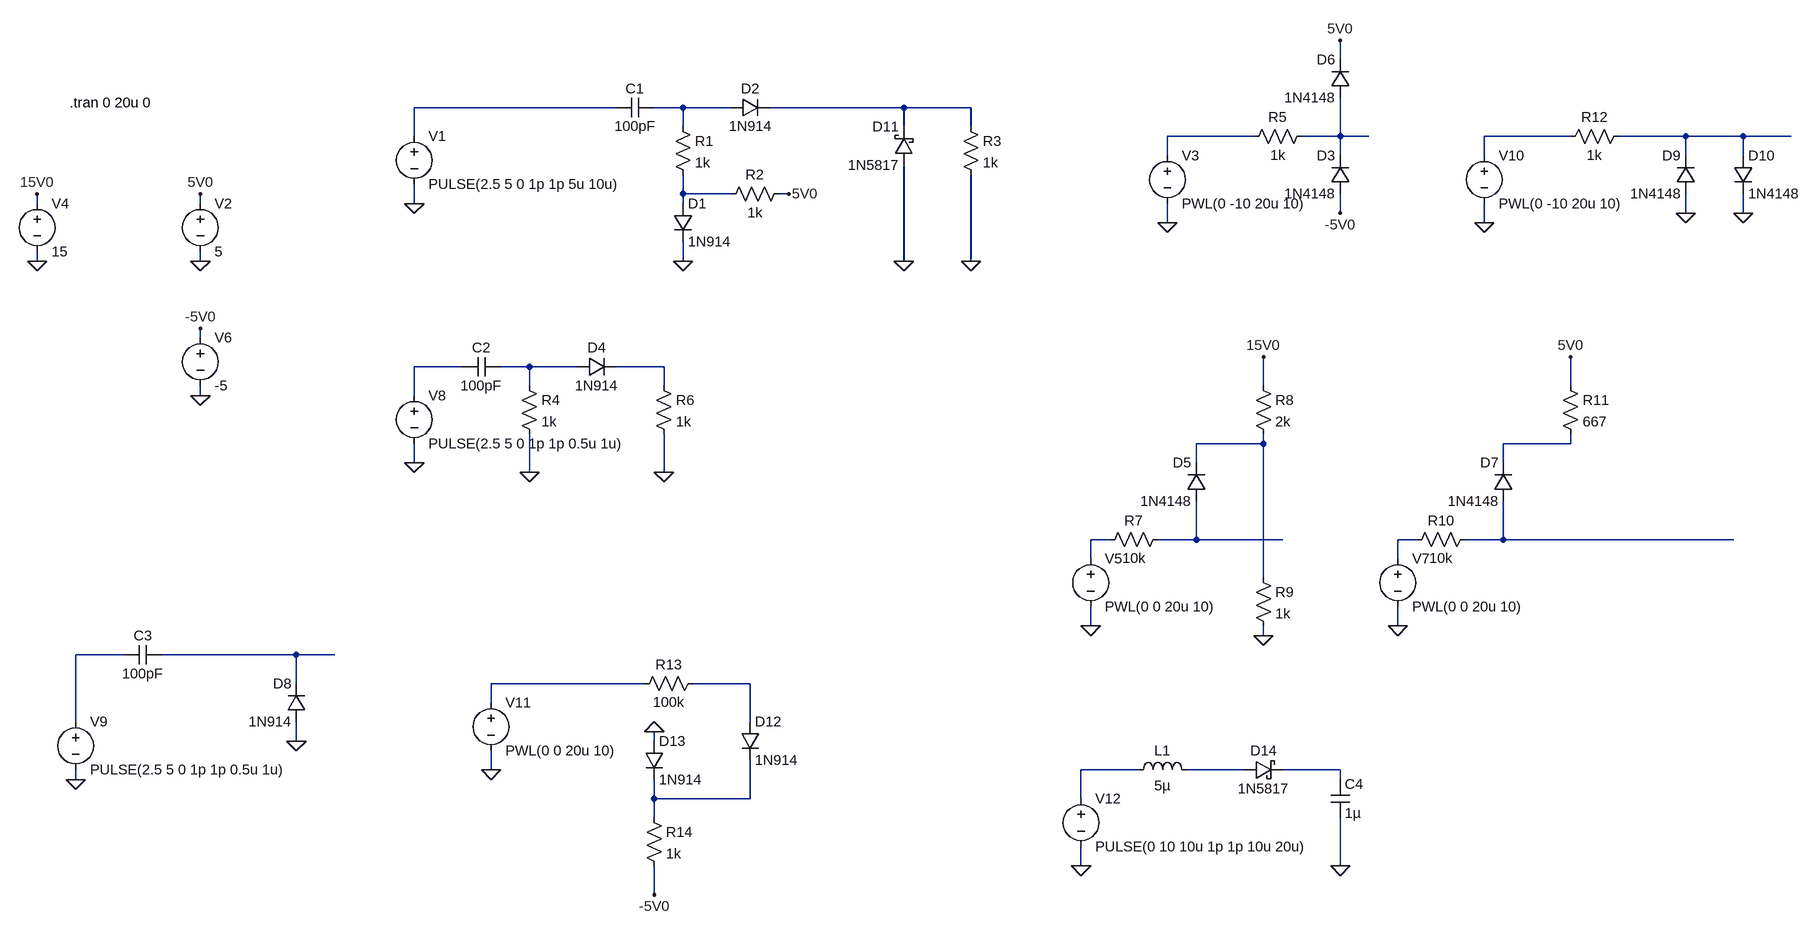
[diagram p0: schematic chapter 1.asc]
chapter 1.asc, the LTspice schematic file:
Version 4
SHEET 1 2712 1636
WIRE 1936 144 1936 112
WIRE 560 224 224 224
WIRE 672 224 624 224
WIRE 752 224 672 224
WIRE 1040 224 816 224
WIRE 1152 224 1040 224
WIRE 672 256 672 224
WIRE 1040 256 1040 224
WIRE 1152 256 1152 224
WIRE 224 272 224 224
WIRE 1792 272 1648 272
WIRE 1936 272 1936 208
WIRE 1936 272 1872 272
WIRE 1984 272 1936 272
WIRE 2320 272 2176 272
WIRE 2512 272 2400 272
WIRE 2608 272 2512 272
WIRE 2688 272 2608 272
WIRE 1648 304 1648 272
WIRE 1936 304 1936 272
WIRE 2176 304 2176 272
WIRE 2512 304 2512 272
WIRE 2608 304 2608 272
WIRE 672 368 672 336
WIRE 752 368 672 368
WIRE 848 368 832 368
WIRE -608 384 -608 368
WIRE -336 384 -336 368
WIRE 224 384 224 352
WIRE 672 384 672 368
WIRE 1936 400 1936 368
WIRE 2512 400 2512 368
WIRE 2608 400 2608 368
WIRE 1648 416 1648 384
WIRE 2176 416 2176 384
WIRE -608 480 -608 464
WIRE -336 480 -336 464
WIRE 672 480 672 448
WIRE 1040 480 1040 320
WIRE 1152 480 1152 336
WIRE -336 608 -336 592
WIRE 304 656 224 656
WIRE 416 656 368 656
WIRE 496 656 416 656
WIRE 640 656 560 656
WIRE 416 688 416 656
WIRE 640 688 640 656
WIRE 1808 688 1808 640
WIRE 2320 688 2320 640
WIRE -336 704 -336 688
WIRE 224 704 224 656
WIRE 1808 784 1808 768
WIRE 1808 784 1696 784
WIRE 2320 784 2320 768
WIRE 2320 784 2208 784
WIRE 224 816 224 784
WIRE 1696 816 1696 784
WIRE 2208 816 2208 784
WIRE 416 832 416 768
WIRE 640 832 640 768
WIRE 1552 944 1520 944
WIRE 1696 944 1696 880
WIRE 1696 944 1632 944
WIRE 1840 944 1696 944
WIRE 2064 944 2032 944
WIRE 2208 944 2208 880
WIRE 2208 944 2144 944
WIRE 2592 944 2208 944
WIRE 1520 976 1520 944
WIRE 2032 976 2032 944
WIRE 1808 1008 1808 784
WIRE 1520 1088 1520 1056
WIRE 2032 1088 2032 1056
WIRE 1808 1104 1808 1088
WIRE -464 1136 -544 1136
WIRE -176 1136 -400 1136
WIRE -112 1136 -176 1136
WIRE -176 1184 -176 1136
WIRE 608 1184 352 1184
WIRE 784 1184 688 1184
WIRE 352 1216 352 1184
WIRE -544 1248 -544 1136
WIRE 784 1248 784 1184
WIRE -176 1280 -176 1248
WIRE 624 1280 624 1264
WIRE 352 1328 352 1296
WIRE 1600 1328 1504 1328
WIRE 1776 1328 1680 1328
WIRE 1936 1328 1840 1328
WIRE -544 1344 -544 1328
WIRE 1936 1344 1936 1328
WIRE 624 1376 624 1344
WIRE 784 1376 784 1312
WIRE 784 1376 624 1376
WIRE 1504 1376 1504 1328
WIRE 624 1408 624 1376
WIRE 1504 1488 1504 1456
WIRE 1936 1488 1936 1408
WIRE 624 1536 624 1488
FLAG 224 384 0
FLAG 672 480 0
FLAG -336 480 0
FLAG -336 368 5V0
FLAG 848 368 5V0
FLAG 1152 480 0
FLAG 416 832 0
FLAG 640 832 0
FLAG 1648 416 0
FLAG 1936 112 5V0
FLAG -608 480 0
FLAG -608 368 15V0
FLAG 1520 1088 0
FLAG 1808 640 15V0
FLAG 1808 1104 0
FLAG -336 704 0
FLAG -336 592 -5V0
FLAG 1936 400 -5V0
FLAG 2032 1088 0
FLAG 2320 640 5V0
FLAG 224 816 0
FLAG -544 1344 0
FLAG -176 1280 0
FLAG 2176 416 0
FLAG 2512 400 0
FLAG 2608 400 0
FLAG 1040 480 0
FLAG 352 1328 0
FLAG 624 1264 0
FLAG 624 1536 -5V0
FLAG 1504 1488 0
FLAG 1936 1488 0
SYMBOL voltage 224 256 R0
WINDOW 123 0 0 Left 0
WINDOW 39 0 0 Left 0
SYMATTR InstName V1
SYMATTR Value PULSE(2.5 5 0 1p 1p 5u 10u)
SYMBOL cap 624 208 R90
WINDOW 0 0 32 VBottom 2
WINDOW 3 32 32 VTop 2
SYMATTR InstName C1
SYMATTR Value 100pF
SYMBOL res 656 240 R0
SYMATTR InstName R1
SYMATTR Value 1k
SYMBOL diode 656 384 R0
SYMATTR InstName D1
SYMATTR Value 1N914
SYMBOL diode 752 240 R270
WINDOW 0 32 32 VTop 2
WINDOW 3 0 32 VBottom 2
SYMATTR InstName D2
SYMATTR Value 1N914
SYMBOL res 848 352 R90
WINDOW 0 0 56 VBottom 2
WINDOW 3 32 56 VTop 2
SYMATTR InstName R2
SYMATTR Value 1k
SYMBOL voltage -336 368 R0
WINDOW 123 0 0 Left 0
WINDOW 39 0 0 Left 0
SYMATTR InstName V2
SYMATTR Value 5
SYMBOL res 1136 240 R0
SYMATTR InstName R3
SYMATTR Value 1k
SYMBOL cap 368 640 R90
WINDOW 0 0 32 VBottom 2
WINDOW 3 32 32 VTop 2
SYMATTR InstName C2
SYMATTR Value 100pF
SYMBOL res 400 672 R0
SYMATTR InstName R4
SYMATTR Value 1k
SYMBOL diode 496 672 R270
WINDOW 0 32 32 VTop 2
WINDOW 3 0 32 VBottom 2
SYMATTR InstName D4
SYMATTR Value 1N914
SYMBOL res 624 672 R0
SYMATTR InstName R6
SYMATTR Value 1k
SYMBOL voltage 1648 288 R0
WINDOW 123 0 0 Left 0
WINDOW 39 0 0 Left 0
SYMATTR InstName V3
SYMATTR Value PWL(0 -10 20u 10)
SYMBOL res 1888 256 R90
WINDOW 0 0 56 VBottom 2
WINDOW 3 32 56 VTop 2
SYMATTR InstName R5
SYMATTR Value 1k
SYMBOL voltage -608 368 R0
WINDOW 123 0 0 Left 0
WINDOW 39 0 0 Left 0
SYMATTR InstName V4
SYMATTR Value 15
SYMBOL voltage 1520 960 R0
WINDOW 123 0 0 Left 0
WINDOW 39 0 0 Left 0
SYMATTR InstName V5
SYMATTR Value PWL(0 0 20u 10)
SYMBOL res 1648 928 R90
WINDOW 0 0 56 VBottom 2
WINDOW 3 32 56 VTop 2
SYMATTR InstName R7
SYMATTR Value 10k
SYMBOL diode 1712 880 R180
WINDOW 0 24 64 Left 2
WINDOW 3 24 0 Left 2
SYMATTR InstName D5
SYMATTR Value 1N4148
SYMBOL res 1792 672 R0
SYMATTR InstName R8
SYMATTR Value 2k
SYMBOL res 1792 992 R0
SYMATTR InstName R9
SYMATTR Value 1k
SYMBOL voltage -336 592 R0
WINDOW 123 0 0 Left 0
WINDOW 39 0 0 Left 0
SYMATTR InstName V6
SYMATTR Value -5
SYMBOL voltage 2032 960 R0
WINDOW 123 0 0 Left 0
WINDOW 39 0 0 Left 0
SYMATTR InstName V7
SYMATTR Value PWL(0 0 20u 10)
SYMBOL res 2160 928 R90
WINDOW 0 0 56 VBottom 2
WINDOW 3 32 56 VTop 2
SYMATTR InstName R10
SYMATTR Value 10k
SYMBOL diode 2224 880 R180
WINDOW 0 24 64 Left 2
WINDOW 3 24 0 Left 2
SYMATTR InstName D7
SYMATTR Value 1N4148
SYMBOL res 2304 672 R0
SYMATTR InstName R11
SYMATTR Value 667
SYMBOL voltage 224 688 R0
WINDOW 123 0 0 Left 0
WINDOW 39 0 0 Left 0
SYMATTR InstName V8
SYMATTR Value PULSE(2.5 5 0 1p 1p 0.5u 1u)
SYMBOL cap -400 1120 R90
WINDOW 0 0 32 VBottom 2
WINDOW 3 32 32 VTop 2
SYMATTR InstName C3
SYMATTR Value 100pF
SYMBOL diode -160 1248 R180
WINDOW 0 24 64 Left 2
WINDOW 3 24 0 Left 2
SYMATTR InstName D8
SYMATTR Value 1N914
SYMBOL voltage -544 1232 R0
WINDOW 123 0 0 Left 0
WINDOW 39 0 0 Left 0
SYMATTR InstName V9
SYMATTR Value PULSE(2.5 5 0 1p 1p 0.5u 1u)
SYMBOL voltage 2176 288 R0
WINDOW 123 0 0 Left 0
WINDOW 39 0 0 Left 0
SYMATTR InstName V10
SYMATTR Value PWL(0 -10 20u 10)
SYMBOL res 2416 256 R90
WINDOW 0 0 56 VBottom 2
WINDOW 3 32 56 VTop 2
SYMATTR InstName R12
SYMATTR Value 1k
SYMBOL diode 1952 368 R180
WINDOW 0 24 64 Left 2
WINDOW 3 24 0 Left 2
SYMATTR InstName D3
SYMATTR Value 1N4148
SYMBOL diode 1952 208 R180
WINDOW 0 24 64 Left 2
WINDOW 3 24 0 Left 2
SYMATTR InstName D6
SYMATTR Value 1N4148
SYMBOL diode 2528 368 R180
WINDOW 0 24 64 Left 2
WINDOW 3 24 0 Left 2
SYMATTR InstName D9
SYMATTR Value 1N4148
SYMBOL diode 2592 304 R0
SYMATTR InstName D10
SYMATTR Value 1N4148
SYMBOL schottky 1056 320 R180
WINDOW 0 24 64 Left 2
WINDOW 3 24 0 Left 2
SYMATTR InstName D11
SYMATTR Value 1N5817
SYMATTR Description Diode
SYMATTR Type diode
SYMBOL voltage 352 1200 R0
WINDOW 123 0 0 Left 0
WINDOW 39 0 0 Left 0
SYMATTR InstName V11
SYMATTR Value PWL(0 0 20u 10)
SYMBOL res 704 1168 R90
WINDOW 0 0 56 VBottom 2
WINDOW 3 32 56 VTop 2
SYMATTR InstName R13
SYMATTR Value 100k
SYMBOL diode 768 1248 R0
SYMATTR InstName D12
SYMATTR Value 1N914
SYMBOL diode 608 1280 R0
SYMATTR InstName D13
SYMATTR Value 1N914
SYMBOL res 608 1392 R0
SYMATTR InstName R14
SYMATTR Value 1k
SYMBOL voltage 1504 1360 R0
WINDOW 123 0 0 Left 0
WINDOW 39 0 0 Left 0
SYMATTR InstName V12
SYMATTR Value PULSE(0 10 10u 1p 1p 10u 20u)
SYMBOL ind 1584 1344 R270
WINDOW 0 32 56 VTop 2
WINDOW 3 5 56 VBottom 2
SYMATTR InstName L1
SYMATTR Value 5µ
SYMBOL schottky 1776 1344 R270
WINDOW 0 32 32 VTop 2
WINDOW 3 0 32 VBottom 2
SYMATTR InstName D14
SYMATTR Value 1N5817
SYMATTR Description Diode
SYMATTR Type diode
SYMBOL cap 1920 1344 R0
SYMATTR InstName C4
SYMATTR Value 1µ
TEXT -554 216 Left 2 !.tran 0 20u 0

The netlist it stands for:
* chapter 1.asc
V1 N001 0 PULSE(2.5 5 0 1p 1p 5u 10u)
C1 N002 N001 100pF
R1 N002 N008 1k
D1 N008 0 1N914
D2 N002 N003 1N914
R2 5V0 N008 1k
V2 5V0 0 5
R3 N003 0 1k
C2 N010 N009 100pF
R4 N010 0 1k
D4 N010 N011 1N914
R6 N011 0 1k
V3 N004 0 PWL(0 -10 20u 10)
R5 N005 N004 1k
V4 15V0 0 15
V5 N014 0 PWL(0 0 20u 10)
R7 N015 N014 10k
D5 N015 N012 1N4148
R8 15V0 N012 2k
R9 N012 0 1k
V6 -5V0 0 -5
V7 N016 0 PWL(0 0 20u 10)
R10 N017 N016 10k
D7 N017 N013 1N4148
R11 5V0 N013 667
V8 N009 0 PULSE(2.5 5 0 1p 1p 0.5u 1u)
C3 N019 N018 100pF
D8 0 N019 1N914
V9 N018 0 PULSE(2.5 5 0 1p 1p 0.5u 1u)
V10 N006 0 PWL(0 -10 20u 10)
R12 N007 N006 1k
D3 -5V0 N005 1N4148
D6 N005 5V0 1N4148
D9 0 N007 1N4148
D10 N007 0 1N4148
D11 0 N003 1N5817
V11 N020 0 PWL(0 0 20u 10)
R13 N021 N020 100k
D12 N021 N025 1N914
D13 0 N025 1N914
R14 N025 -5V0 1k
V12 N022 0 PULSE(0 10 10u 1p 1p 10u 20u)
L1 N022 N023 5µ
D14 N023 N024 1N5817
C4 N024 0 1µ
.model D D
.lib standard.dio
.tran 0 20u 0
.backanno
.end